# Altium schematic sheet Ethernet.SchDoc: Ethernet
size 279 x 215 mm; Engineer: Prasoon Sinha; DocumentNumber: 3; SheetNumber: 10; SheetTotal: 26
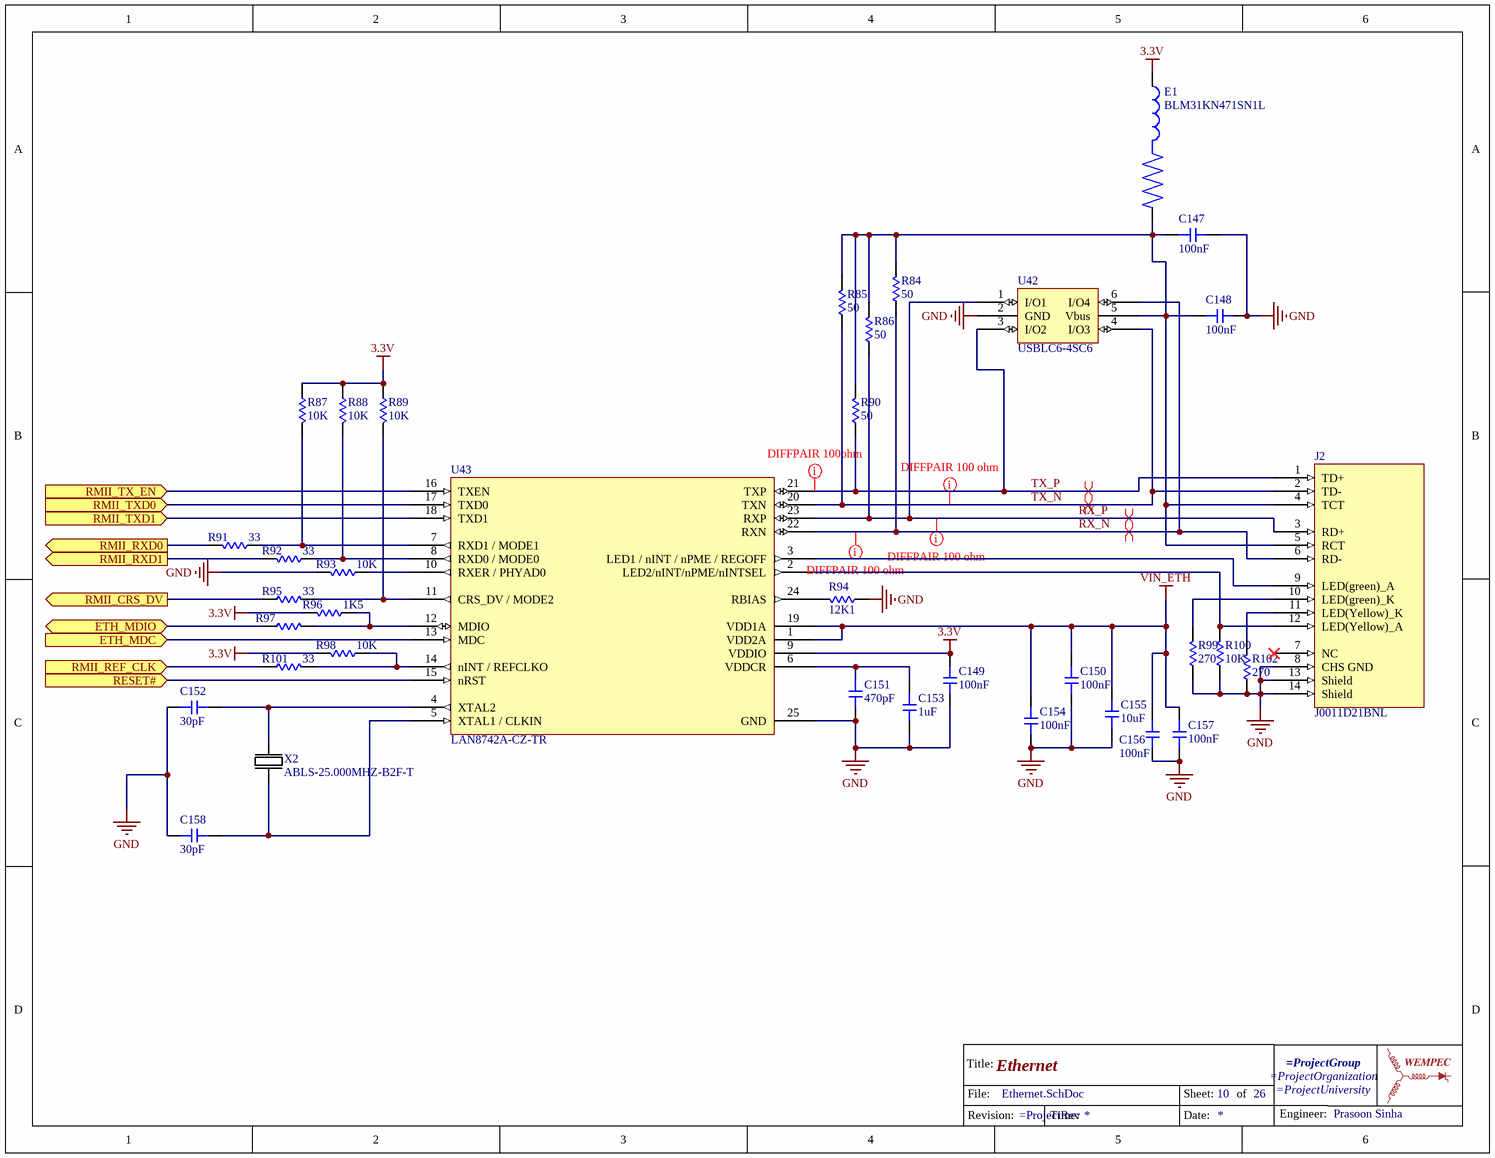
[diagram p0: Ethernet.SchDoc]

## Parts
*?  TitleBlockWEMPEC  (value not drawn)  (graphical)
C147  value 100nF  [0603-CAP]  (hidden comment: Capacitor)
C148  value 100nF  [0603-CAP]  (hidden comment: Capacitor)
C149  value 100nF  [0603-CAP]  (hidden comment: Capacitor)
C150  value 100nF  [0603-CAP]  (hidden comment: Capacitor)
C151  470pF  [0603-CAP]
C152  30pF  [0603-CAP]
C153  1uF  [0603-CAP]
C154  value 100nF  [0603-CAP]  (hidden comment: Capacitor)
C155  10uF  [0603-CAP]
C156  value 100nF  [0603-CAP]  (hidden comment: Capacitor)
C157  value 100nF  [0603-CAP]  (hidden comment: Capacitor)
C158  30pF  [0603-CAP]
E1  BLM31KN471SN1L  [BEADC3216X180N]
J2  J0011D21BNL  [J0011D21BNL]
R84  value 50  [0603-RES]  (hidden comment: Resistor)
R85  value 50  [0603-RES]  (hidden comment: Resistor)
R86  value 50  [0603-RES]  (hidden comment: Resistor)
R87  value 10K  [0603-RES]  (hidden comment: Resistor)
R88  value 10K  [0603-RES]  (hidden comment: Resistor)
R89  value 10K  [0603-RES]  (hidden comment: Resistor)
R90  value 50  [0603-RES]  (hidden comment: Resistor)
R91  value 33  [0603-RES]  (hidden comment: Resistor)
R92  value 33  [0603-RES]  (hidden comment: Resistor)
R93  value 10K  [0603-RES]  (hidden comment: Resistor)
R94  value 12K1  [0603-RES]  (hidden comment: Resistor)
R95  value 33  [0603-RES]  (hidden comment: Resistor)
R96  value 1K5  [0603-RES]  (hidden comment: Resistor)
R97  Resistor  [0603-RES]  (value not drawn)
R98  value 10K  [0603-RES]  (hidden comment: Resistor)
R99  value 270  [0603-RES]  (hidden comment: Resistor)
R100  value 10K  [0603-RES]  (hidden comment: Resistor)
R101  value 33  [0603-RES]  (hidden comment: Resistor)
R102  value 270  [0603-RES]  (hidden comment: Resistor)
U42  USBLC6-4SC6  [SOT95P280X145-6N]
U43  LAN8742A-CZ-TR  [QFN50P400X400X100_HS-25N]
X2  ABLS-25.000MHZ-B2F-T  [XTAL_ABLS-8.000MHZ-B2-T]

## Ports
ETH_MDC (in), ETH_MDIO (bidir), RESET# (in), RMII_CRS_DV (out), RMII_REF_CLK (in), RMII_RXD0 (out), RMII_RXD1 (out), RMII_TX_EN (in), RMII_TXD0 (in), RMII_TXD1 (in)

## Nets
3.3V: C149.2 E1.1 R87.1 R88.1 R89.1 R96.2 R98.2 U43.9(VDDIO)
GND: C147.1 C148.1 C149.1 C150.1 C151.1 C152.2 C153.1 C154.1 C155.1 C156.1 C157.1 C158.2 J2.8(CHS_GND) J2.13(Shield) J2.14(Shield) R93.2 R94.1 R99.1 R100.1 R102.1 U42.2(GND) U43.25(GND)
VIN_ETH: C150.2 C154.2 C155.2 C156.2 C157.2 U43.1(VDD2A) U43.19(VDD1A)
ETH_MDC: U43.13(MDC) ; port ETH_MDC
ETH_MDIO: R97.1 ; port ETH_MDIO
RESET#: U43.15(nRST) ; port RESET#
RMII_CRS_DV: R95.1 ; port RMII_CRS_DV
RMII_REF_CLK: R101.1 ; port RMII_REF_CLK
RMII_RXD0: R91.2 ; port RMII_RXD0
RMII_RXD1: R92.2 ; port RMII_RXD1
RMII_TX_EN: U43.16(TXEN) ; port RMII_TX_EN
RMII_TXD0: U43.17(TXD0) ; port RMII_TXD0
RMII_TXD1: U43.18(TXD1) ; port RMII_TXD1
RX_N: J2.6(RD-) R84.1 U42.6(I/O4) U43.22(RXN)
RX_P: J2.3(RD+) R86.1 U42.1(I/O1) U43.23(RXP)
TX_N: J2.2(TD-) R85.1 U42.4(I/O3) U43.20(TXN)
TX_P: J2.1(TD+) R90.1 U42.3(I/O2) U43.21(TXP)
NetC147_2: C147.2 C148.2 E1.2 J2.4(TCT) J2.5(RCT) R84.2 R85.2 R86.2 R90.2 U42.5(Vbus)
NetC151_2: C151.2 C153.2 U43.6(VDDCR)
NetC152_1: C152.1 U43.4(XTAL2) X2.2
NetC158_1: C158.1 U43.5(XTAL1_/_CLKIN) X2.1
NetJ2_9: J2.9(LED(green)_A) U43.3(LED1_/_nINT_/_nPME_/_REGOFF)
NetJ2_10: J2.10(LED(green)_K) R99.2
NetJ2_11: J2.11(LED(Yellow)_K) R102.2
NetJ2_12: J2.12(LED(Yellow)_A) R100.2 U43.2(LED2/nINT/nPME/nINTSEL)
NetR87_2: R87.2 R91.1 U43.7(RXD1_/_MODE1)
NetR88_2: R88.2 R92.1 U43.8(RXD0_/_MODE0)
NetR89_2: R89.2 R95.2 U43.11(CRS_DV_/_MODE2)
NetR93_1: R93.1 U43.10(RXER_/_PHYAD0)
NetR94_2: R94.2 U43.24(RBIAS)
NetR96_1: R96.1 R97.2 U43.12(MDIO)
NetR98_1: R98.1 R101.2 U43.14(nINT_/_REFCLKO)

Not connected (* = marked no-connect by the designer): J2 7(NC)*

## Layout directives
differential pair: RX_N, RX_P, TX_N, TX_P
mark named DIFFPAIR 100ohm: TX_P
mark named DIFFPAIR 100 ohm: RX_N, RX_P, TX_N

## Notes on the sheet
- (in symbol TitleBlockWEMPEC) Title:; File:; Sheet:; of; Engineer:; Revision:; Time:; Date:

## Library data of the parts
C151-C153 C155 C158 = Capacitor
  C151: Supplier Part Number 1: 709-1085-1-ND
  C152 C158: Supplier Part Number 1: 311-3894-1-ND
  C153: Supplier Part Number 1: 1276-6524-1-ND
  C155: Supplier Part Number 1: 311-3494-1-ND
E1 = BLM31KN471SN1L: Power Line Ferrite Bead 1206 (3216 Metric) 4A 20mOhm; Supplier Part Number 1: 490-16530-1-ND
J2 = J0011D21BNL: 1 Port RJ45 Magjack Connector Through Hole 10/100 Base-TX, AutoMDIX; Supplier Part Number 1: 553-1485-ND
R97 = Resistor: Value: 0; Supplier 1: Digi-Key; Supplier Part Number 1: 311-470LDCT-ND
U42 = USBLC6-4SC6: 17V Clamp 5A (8/20µs) Ipp Tvs Diode Surface Mount SOT-23-6; Supplier Part Number 1: 497-4492-1-ND
U43 = LAN8742A-CZ-TR: 1/1 Transceiver Ethernet 24-SQFN (4x4); Supplier Part Number 1: LAN8742A-CZ-CT-ND
X2 = ABLS-25.000MHZ-B2F-T: 25MHz ±20ppm Crystal 18pF 40 Ohms HC-49/US; Supplier Part Number 1: 535-9078-1-ND
C147-C150 C154 C156 C157 = Capacitor: Supplier 1: Digi-Key; Supplier Part Number 1: 1276-1012-1-ND
R84-R96 R98-R102 = Resistor: Supplier 1: Digi-Key
  R84-R86 R90: Supplier Part Number 1: 541-3318-1-ND
  R87-R89 R93 R98 R100: Supplier Part Number 1: 541-5136-1-ND
  R91 R92 R95 R101: Supplier Part Number 1: RMCF0603FT33R0CT-ND
  R94: Supplier Part Number 1: 541-5158-1-ND
  R96: Supplier Part Number 1: RMCF0603FT1K50CT-ND
  R99 R102: Supplier Part Number 1: 541-270HCT-ND